# Altium project PCB_Project.PrjPcb
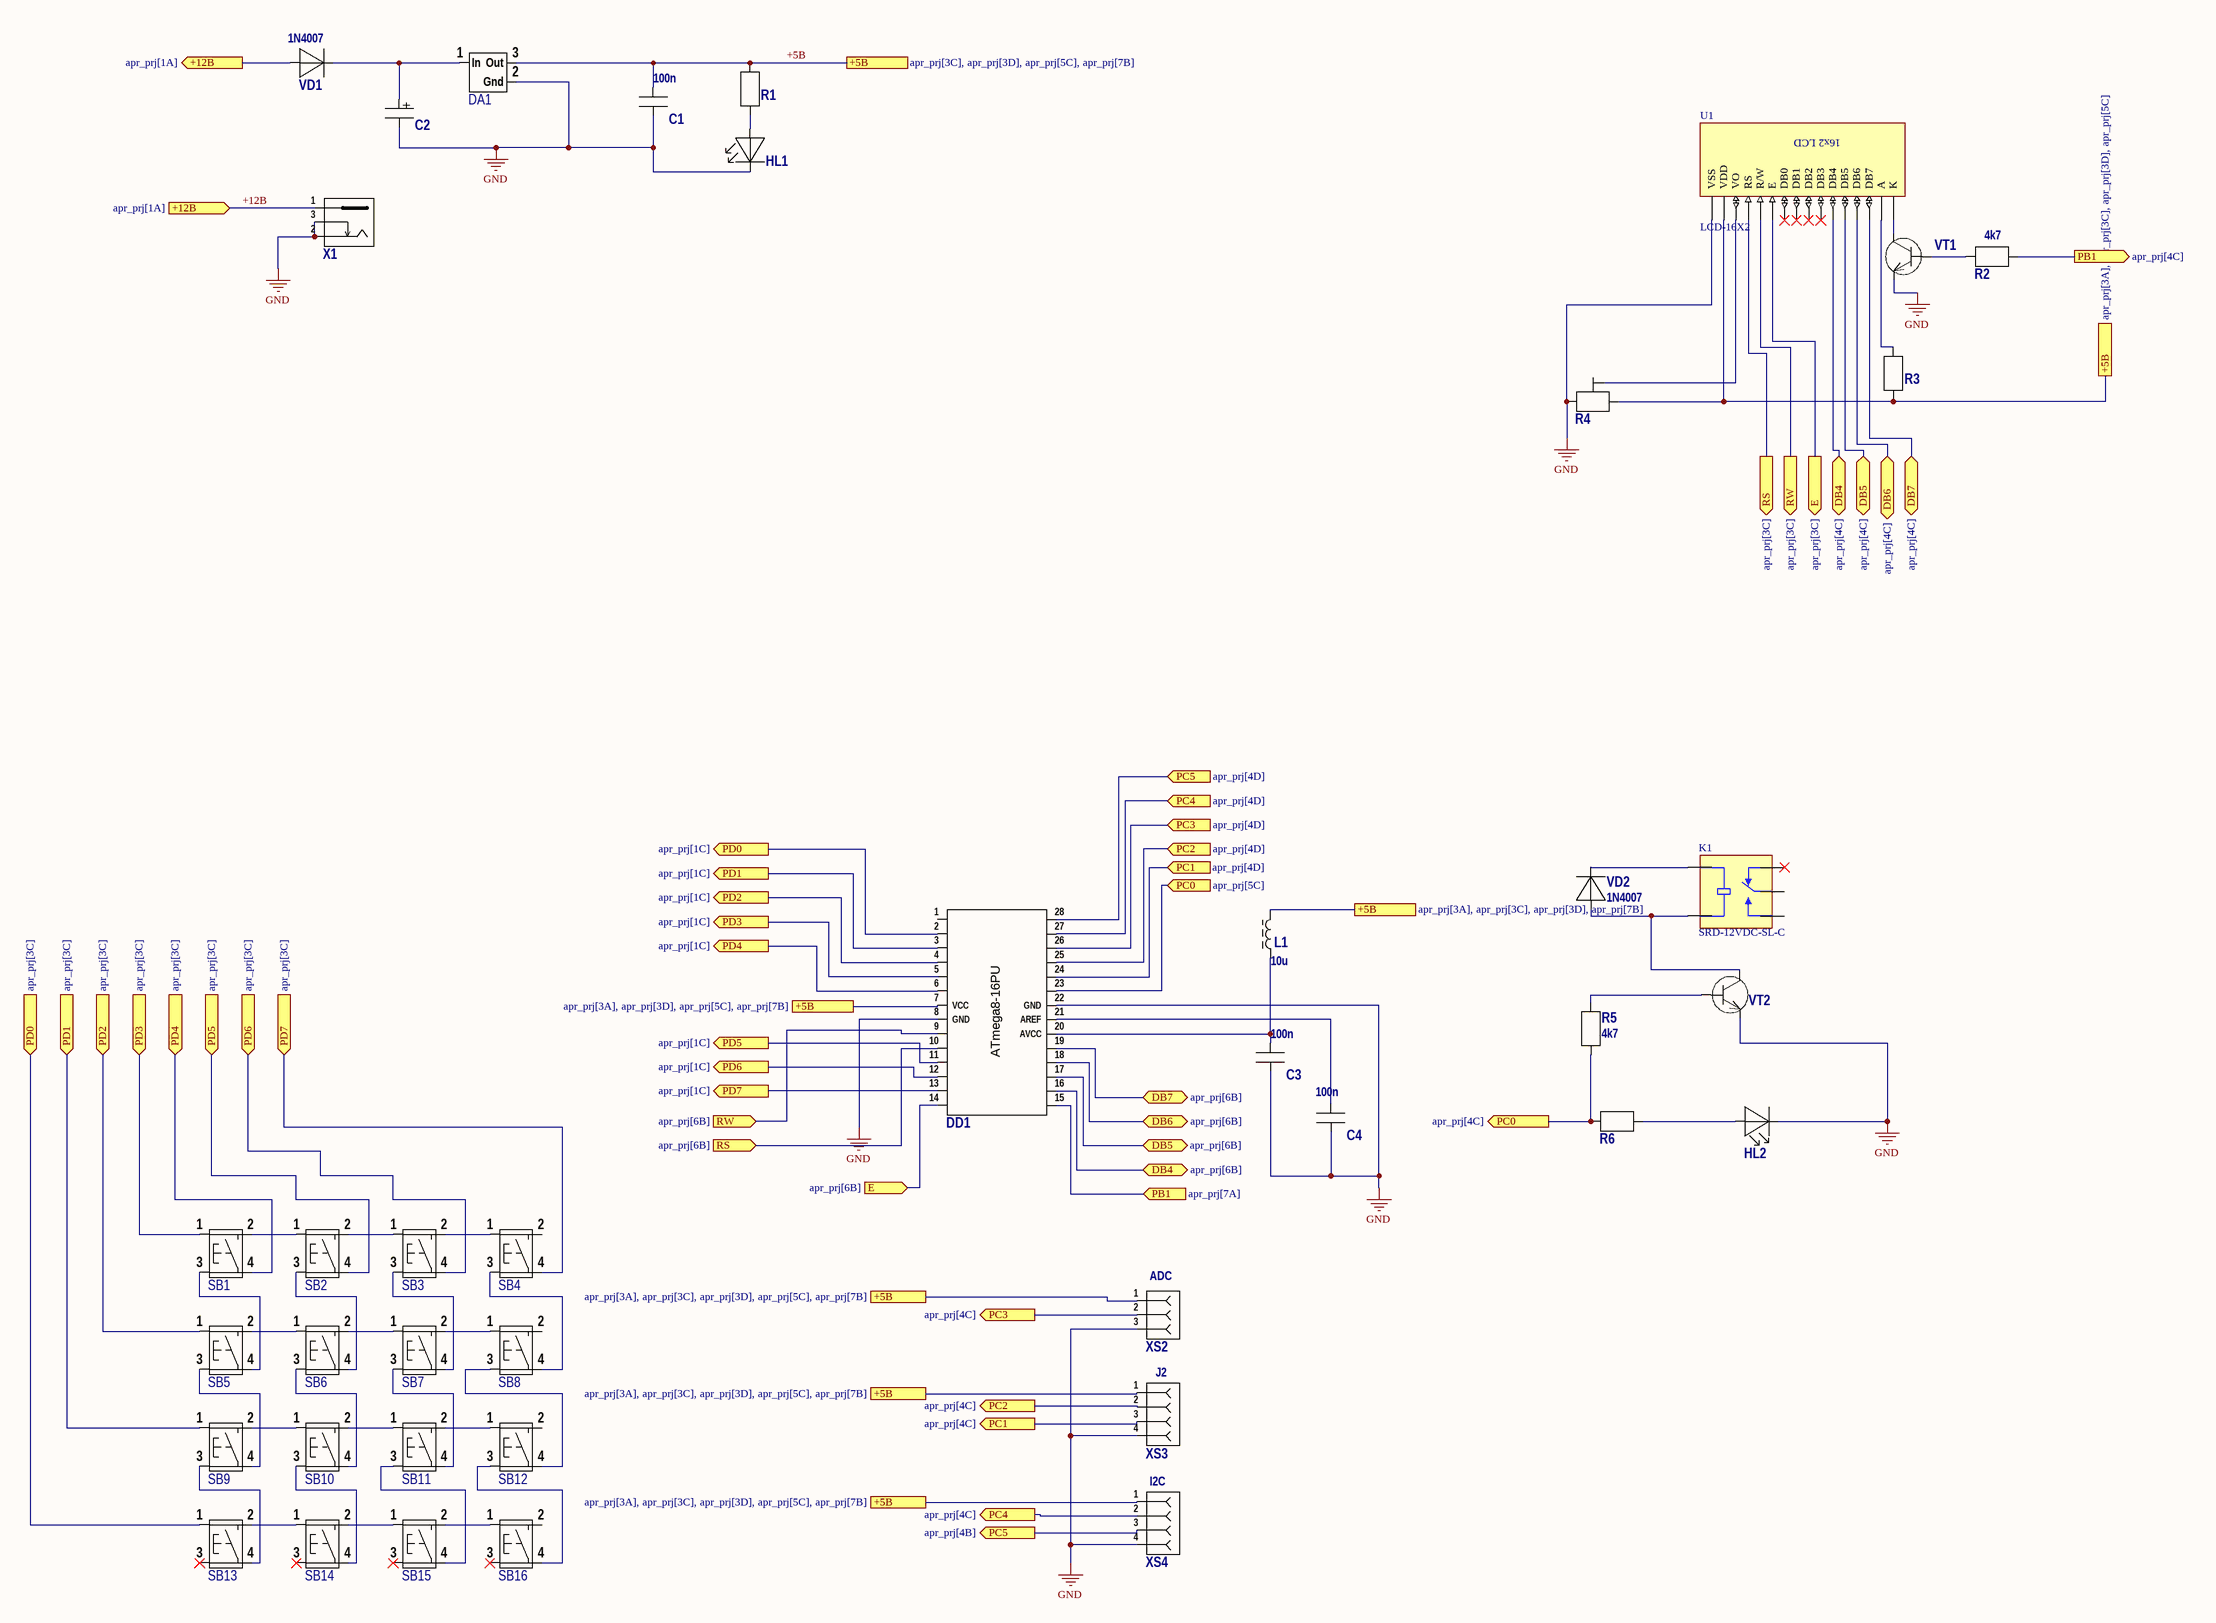
[diagram p0: apr_prj.SchDoc]
1 sheet, 41 parts. Net scope: flat (ports and power ports of the same name join across sheets).
Board file: apr_board.PcbDoc

## Sheet apr_prj.SchDoc
size A2; SheetNumber: 1; SheetTotal: 1

### Parts
C1  100n  [CAP 0603 3D]
C2  C Al R  [capr- 2.5D6.5H12]  (value not drawn)
C3  100n  [CAP 0603 3D]
C4  100n  [CAP 0603 3D]
DA1  LM78xx  [TO-220_В]  (value not drawn)
DD1  ATmega8-16PU  [DIP-28  (300)]  (value not drawn)
HL1  fyls-0805???  [СД_SMD 2012_110]  (value not drawn)
HL2  fyls-0805???  [СД_SMD 2012_110]  (value not drawn)
K1  SRD-12VDC-SL-C  [RELAY_SRD-12VDC-SL-C]
L1  10u  [B82422]
R1  R  [Res_0805 3D]  (value not drawn)
R2  4k7  [Res_0805 3D]
R3  R  [Res_0805 3D]  (value not drawn)
R4  R POT  [POT SH-655MCL]  (value not drawn)
R5  4k7  [Res_0805 3D]
R6  R  [Res_0805 3D]  (value not drawn)
SB1  0670HIM  [250 _ 6,0-6,0-7,0]  (value not drawn)
SB2  0670HIM  [250 _ 6,0-6,0-7,0]  (value not drawn)
SB3  0670HIM  [250 _ 6,0-6,0-7,0]  (value not drawn)
SB4  0670HIM  [250 _ 6,0-6,0-7,0]  (value not drawn)
SB5  0670HIM  [250 _ 6,0-6,0-7,0]  (value not drawn)
SB6  0670HIM  [250 _ 6,0-6,0-7,0]  (value not drawn)
SB7  0670HIM  [250 _ 6,0-6,0-7,0]  (value not drawn)
SB8  0670HIM  [250 _ 6,0-6,0-7,0]  (value not drawn)
SB9  0670HIM  [250 _ 6,0-6,0-7,0]  (value not drawn)
SB10  0670HIM  [250 _ 6,0-6,0-7,0]  (value not drawn)
SB11  0670HIM  [250 _ 6,0-6,0-7,0]  (value not drawn)
SB12  0670HIM  [250 _ 6,0-6,0-7,0]  (value not drawn)
SB13  0670HIM  [250 _ 6,0-6,0-7,0]  (value not drawn)
SB14  0670HIM  [250 _ 6,0-6,0-7,0]  (value not drawn)
SB15  0670HIM  [250 _ 6,0-6,0-7,0]  (value not drawn)
SB16  0670HIM  [250 _ 6,0-6,0-7,0]  (value not drawn)
U1  LCD-16X2  [MODULE_LCD-16X2]
VD1  1N4007  [DO-41  (7.5)]
VD2  1N4007  [DO-41  (7.5)]
VT1  VT NPN  [КТ-26 КБЭ (2)]  (value not drawn)
VT2  VT NPN  [КТ-26 КБЭ (2)]  (value not drawn)
X1  Гнездо  [XKB_DC-005-5A-2.0]  (value not drawn)
XS2  ADC  [DS1023-1*03]
XS3  J2  [DS1023-1*04]
XS4  I2C  [DS1023-1*04]

### Ports
+5В (see apr_prj[3A], apr_prj[3C], apr_prj[3D], apr_prj[5C]), +5В (see apr_prj[3A], apr_prj[3C], apr_prj[3D], apr_prj[5C], apr_prj[7B]), +5В (see apr_prj[3A], apr_prj[3C], apr_prj[3D], apr_prj[7B]), +5В (see apr_prj[3A], apr_prj[3D], apr_prj[5C], apr_prj[7B]), +5В (see apr_prj[3C], apr_prj[3D], apr_prj[5C], apr_prj[7B]), +12В (in, see apr_prj[1A]), +12В (out, see apr_prj[1A]), DB4 (bidir, see apr_prj[4C]), DB4 (bidir, see apr_prj[6B]), DB5 (bidir, see apr_prj[4C]), DB5 (bidir, see apr_prj[6B]), DB6 (bidir, see apr_prj[4C]), DB6 (bidir, see apr_prj[6B]), DB7 (bidir, see apr_prj[4C]), DB7 (bidir, see apr_prj[6B]), E (in, see apr_prj[6B]), E (out, see apr_prj[3C]), PB1 (in, see apr_prj[7A]), PB1 (out, see apr_prj[4C]), PC0 (in, see apr_prj[5C]), PC0 (out, see apr_prj[4C]), PC1 (in, see apr_prj[4D]), PC1 (out, see apr_prj[4C]), PC2 (in, see apr_prj[4D]), PC2 (out, see apr_prj[4C]), PC3 (in, see apr_prj[4D]), PC3 (out, see apr_prj[4C]), PC4 (in, see apr_prj[4D]), PC4 (out, see apr_prj[4C]), PC5 (in, see apr_prj[4D]), PC5 (out, see apr_prj[4B]), PD0 (in, see apr_prj[3C]), PD0 (out, see apr_prj[1C]), PD1 (in, see apr_prj[3C]), PD1 (out, see apr_prj[1C]), PD2 (in, see apr_prj[3C]), PD2 (out, see apr_prj[1C]), PD3 (in, see apr_prj[3C]), PD3 (out, see apr_prj[1C]), PD4 (in, see apr_prj[3C]), PD4 (out, see apr_prj[1C]), PD5 (in, see apr_prj[3C]), PD5 (out, see apr_prj[1C]), PD6 (in, see apr_prj[3C]), PD6 (out, see apr_prj[1C]), PD7 (in, see apr_prj[3C]), PD7 (out, see apr_prj[1C]), RS (in, see apr_prj[6B]), RS (out, see apr_prj[3C]), RW (in, see apr_prj[6B]), RW (out, see apr_prj[3C])

### Nets
GND: C1.2 C2.1(-) C3.2 C4.2 DA1.2(Gnd) DD1.8(GND) DD1.22(GND) HL1.1(K) HL2.1(K) R4.1 U1.1(VSS) VT1.3(E) VT2.3(E) X1.2 X1.3 XS2.3 XS3.4 XS4.4
+5В: C1.1 DA1.3(Out) DD1.7(VCC) L1.2 R1.2 R3.1 R4.3 U1.2(VDD) XS2.1 XS3.1 XS4.1 ; port +5В
+12В: VD1.2(A) X1.1 ; port +12В
NetC2_2: C2.2(+) DA1.1(In) VD1.1(K)
NetC3_1: C3.1 DD1.20(AVCC) L1.1
NetC4_1: C4.1 DD1.21(AREF)
NetDD1_2: DD1.2((RXD)_PD0) SB13.1 ; port PD0
NetDD1_3: DD1.3((TXD)_PD1) SB9.1 ; port PD1
NetDD1_4: DD1.4((INT0)_PD2) SB5.1 ; port PD2
NetDD1_5: DD1.5((INT1)_PD3) SB1.1 ; port PD3
NetDD1_6: DD1.6((XCK/T0)_PD4) SB1.4 ; port PD4
NetDD1_9: DD1.9((XTAL1/TOSC1)_PB6) U1.5(R/W) ; port RW
NetDD1_10: DD1.10((XTAL2/TOSC2)_PB7) U1.4(RS) ; port RS
NetDD1_11: DD1.11((T1)_PD5) SB2.4 ; port PD5
NetDD1_12: DD1.12((AIN0)_PD6) SB3.4 ; port PD6
NetDD1_13: DD1.13((AIN1)_PD7) SB4.4 ; port PD7
NetDD1_14: DD1.14((ICP1)_PB0) U1.6(E) ; port E
NetDD1_15: DD1.15(PB1_(OC1A)) R2.1 ; port PB1
NetDD1_16: DD1.16(PB2_(SS/OC1B)) U1.11(DB4) ; port DB4
NetDD1_17: DD1.17(PB3_(MOSI/OC2)) U1.12(DB5) ; port DB5
NetDD1_18: DD1.18(PB4_(MISO)) U1.13(DB6) ; port DB6
NetDD1_19: DD1.19(PB5_(SCK)) U1.14(DB7) ; port DB7
NetDD1_23: DD1.23(PC0_(ADC0)) R5.2 R6.2 ; port PC0
NetDD1_24: DD1.24(PC1_(ADC1)) XS3.3 ; port PC1
NetDD1_25: DD1.25(PC2_(ADC2)) XS3.2 ; port PC2
NetDD1_26: DD1.26(PC3_(ADC3)) XS2.2 ; port PC3
NetDD1_27: DD1.27(PC4_(ADC4/SDA)) XS4.2 ; port PC4
NetDD1_28: DD1.28(PC5_(ADC5/SCL)) XS4.3 ; port PC5
NetHL1_2: HL1.2(A) R1.1
NetHL2_2: HL2.2(A) R6.1
NetK1_COIL1: K1.COIL1 VD2.1(K)
NetK1_COIL2: K1.COIL2 VD2.2(A) VT2.2(C)
NetR2_2: R2.2 VT1.1(B)
NetR3_2: R3.2 U1.15(A)
NetR4_2: R4.2 U1.3(VO)
NetR5_1: R5.1 VT2.1(B)
NetSB1_2: SB1.2 SB2.1
NetSB1_3: SB1.3 SB5.4
NetSB2_2: SB2.2 SB3.1
NetSB2_3: SB2.3 SB6.4
NetSB3_2: SB3.2 SB4.1
NetSB3_3: SB3.3 SB7.4
NetSB4_3: SB4.3 SB8.4
NetSB5_2: SB5.2 SB6.1
NetSB5_3: SB5.3 SB9.4
NetSB6_2: SB6.2 SB7.1
NetSB6_3: SB6.3 SB10.4
NetSB7_2: SB7.2 SB8.1
NetSB7_3: SB7.3 SB11.4
NetSB8_3: SB8.3 SB12.4
NetSB9_2: SB9.2 SB10.1
NetSB9_3: SB9.3 SB13.4
NetSB10_2: SB10.2 SB11.1
NetSB10_3: SB10.3 SB14.4
NetSB11_2: SB11.2 SB12.1
NetSB11_3: SB11.3 SB15.4
NetSB12_3: SB12.3 SB16.4
NetSB13_2: SB13.2 SB14.1
NetSB14_2: SB14.2 SB15.1
NetSB15_2: SB15.2 SB16.1
NetU1_16: U1.16(K) VT1.2(C)

Not connected (* = marked no-connect by the designer): DD1 1((RESET)_PC6); K1 COM NC* NO; SB4 2; SB8 2; SB12 2; SB13 3*; SB14 3*; SB15 3*; SB16 2 3*; U1 7(DB0)* 8(DB1)* 9(DB2)* 10(DB3)*

### Notes on the sheet
- (in symbol LCD-16X2) 16x2 LCD

### Library data of the parts
C1 C3 C4 = C: Конденсатор керамика
C2 = C Al R: Конденсатор алюминиевый радиальный
DA1 = LM78xx: Регулируемый стабилизатор напряжения     5…15V
DD1 = ATmega8-16PU: Микроконтроллер 8-Бит   AVR   16МГц   8КБ Flash [DIP-28]
HL1 HL2 = fyls-0805....: Св. д. ЧИП 2012 (0805)
K1 = SRD-12VDC-SL-C: General Purpose Non Latching 12VDC SPDT Through Hole Relays RoHS; MF: Songle Relay; SnapEDA_Link: https://www.snapeda.com/parts/SRD-12VDC-SL-C/Songle+Relay/view-part/?ref=snap; Package: NON STANDARD-5 Songle Relay; Value: *; MP: SRD-12VDC-SL-C; Check_prices: https://www.snapeda.com/parts/SRD-12VDC-SL-C/Songle+Relay/view-part/?ref=eda
L1 = L x1: Индуктивность ЧИП (SMD)
R1-R3 R5 R6 = R: Резисторы плёночные (SMD; МЛТ; С2-33Н; MP9xxx)
R4 = R POT: Потенциометр BOURNS
SB1-SB16 = 1_0670HIM: Кнопка тактовая
U1 = LCD-16X2: Display Development Tools 16x2 Black on Green Char LCD w Backlight; MF: Gravitech; SnapEDA_Link: https://www.snapeda.com/parts/LCD-16X2/Gravitech/view-part/?ref=snap; Package: None; Value: *; MP: LCD-16X2; Check_prices: https://www.snapeda.com/parts/LCD-16X2/Gravitech/view-part/?ref=eda
VD1 VD2 = Диод.  x1  (2): Диод  одиночный
VT1 VT2 = VT NPN: Транзистор NPN
X1 = Гнездо с выкл.: Разъём питания
XS2 = Розет 1* 3  (2): Гнездо на плату 2.54мм 1х3 pin
XS3 XS4 = Розет 1* 4  (2): Гнездо на плату 2.54мм 1х4 pin